# EAGLE schematic 02A-003 Input Switch (EAGLE 6.3)
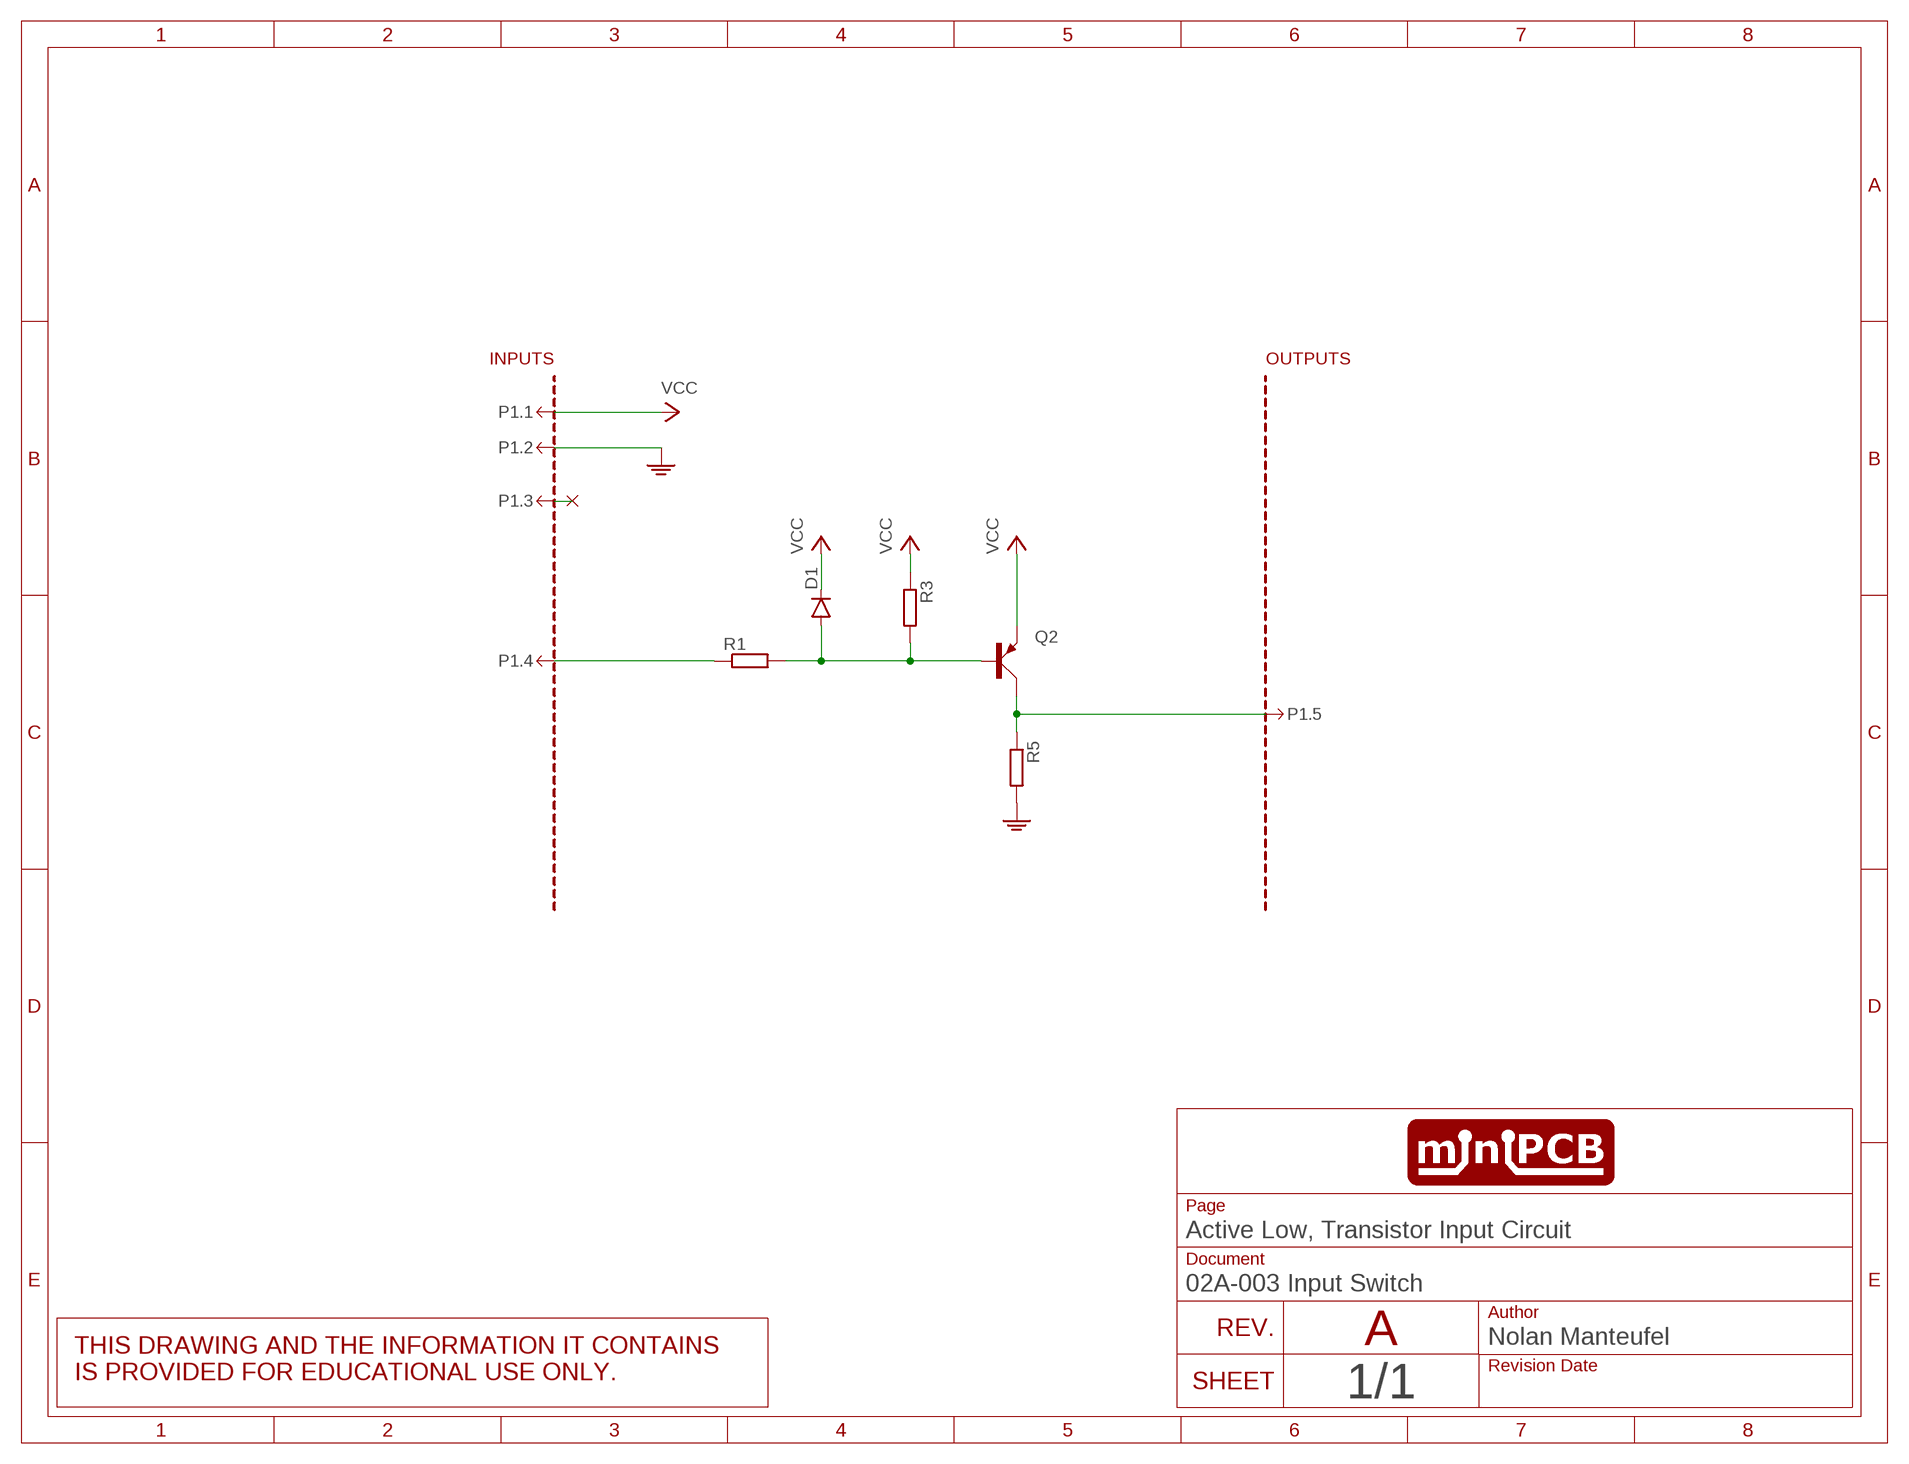
[diagram p0: schematic, sheet 1]

## Parts
D1  DIODE-SOD80C  [SOD80C]
P1.  MINIPCB_4INCH  [PCB_5]
Q2  BJT_PNPBEC  [SOT23]
R1  R-EU_R0805  [R0805]
R3  R-EU_R0805  [R0805]
R5  R-EU_R0805  [R0805]

## Nets
GND: P1..1 R5.2
INPUT: P1..4 R1.1
N$1: D1.A Q2.1(B) R1.2 R3.2
N$2: P1..3
N$5: P1..5 Q2.3(C) R5.1
VCC: D1.C P1..2 Q2.2(E) R3.1

## Notes on the sheet
- A

## Library data of the parts
D1 = nolan:DIODE-: DIODE
P1. = nolan:MINIPCB_4INCH
Q2 = nolan:BJT_PNP
R1 R3 R5 = nolan:R-EU_: RESISTOR, European symbol